# EAGLE design simple-buffer-with-jacks-V0-2 (EAGLE 7.5.0)
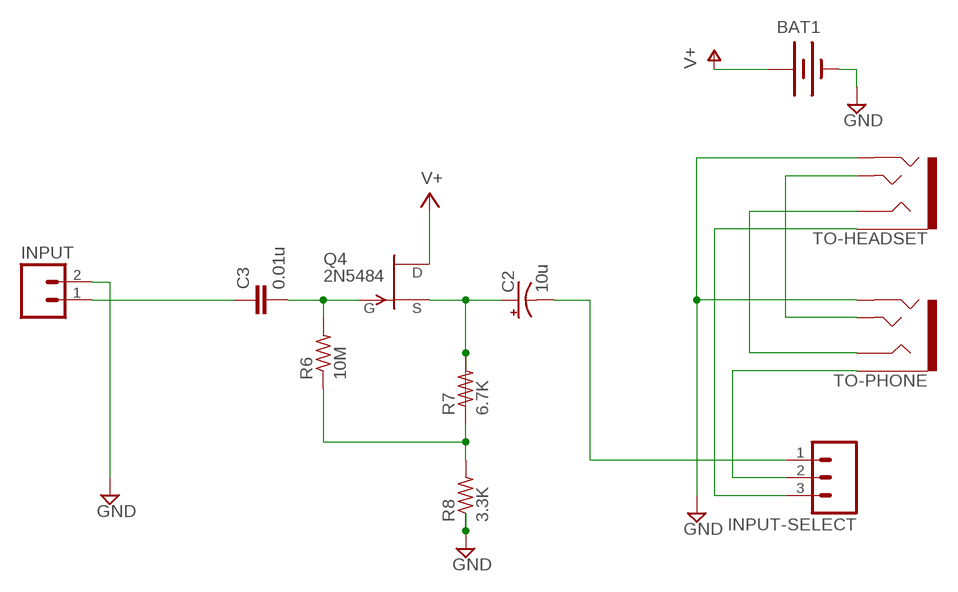
[diagram p0: schematic, sheet 1]

## Parts
BAT1  BATTERYAAA-KIT  [BATTERY-AAA-KIT]
C2  10u  CAP_POLPTH2  [CPOL-RADIAL-10UF-25V]
C3  0.01u  C5/3  [C5B3]
INPUT  M02LOCK  [1X02_LOCK]
INPUT-SELECT  M03LOCK  [1X03_LOCK]
Q4  2N5484  [TO92-]
R6  10M  R-US_0414/5V  [0414V]
R7  6.7K  R-US_0414/5V  [0414V]
R8  3.3K  R-US_0414/5V  [0414V]
TO-HEADSET  AUDIO-JACK3  [AUDIO-JACK-TRRS-SMD]
TO-PHONE  AUDIO-JACK3  [AUDIO-JACK-TRRS-SMD]

## Nets
GND: BAT1.GND@1(-) INPUT.2 R8.1 TO-HEADSET.RING2 TO-PHONE.RING2
JFET-GATE: C3.2 Q4.1(G) R6.2
JFET-SOURCE: C2.1(+) Q4.2(S) R7.2
N$1: C3.1 INPUT.1
N$2: C2.2(-) INPUT-SELECT.1
N$7: INPUT-SELECT.3 TO-HEADSET.EARTH
N$8: TO-HEADSET.TIP TO-PHONE.TIP
N$9: TO-HEADSET.RING1 TO-PHONE.RING1
N$10: R6.1 R7.1 R8.2
TO-PHONE: INPUT-SELECT.2 TO-PHONE.EARTH
V+: BAT1.PWR@1(+) Q4.3(D)

## Library data of the parts
BAT1 = Daniel:BATTERY: Battery Holders Various common sizes : AA, AAA, 18650 (PRT-12895), 20mm coin cell and 12mm coin cell. 20MM_4LEGS, BATT-10373; PROD_ID: BATT-08571
C2 = SparkFun-Passives:CAP_POL: Capacitor Polarized These are standard SMD and PTH capacitors. Normally 10uF, 47uF, and 100uF in electrolytic and tantalum varieties. Always verify the external diameter of the through hole cap, it varies with capacity, voltage, and manufacturer. The EIA devices should be standard.
C3 = capacitor-wima:C: CAPACITOR naming: grid - package width
INPUT = CMU-ArtFab:M02: Header 2 Standard 2-pin 0.1" header. Use with straight break away headers (SKU : PRT-00116), right angle break away headers (PRT-00553), swiss pins (PRT-00743), machine pins (PRT-00117), and female headers (PRT-00115). Molex polarized connector foot print use with SKU : PRT-08233 with associated crimp pins and housings.
INPUT-SELECT = SparkFun-Connectors:M03: Header 3 Standard 3-pin 0.1" header. Use with straight break away headers (SKU : PRT-00116), right angle break away headers (PRT-00553), swiss pins (PRT-00743), machine pins (PRT-00117), and female headers (PRT-00115). Molex polarized connector foot print use with SKU : PRT-08232 with associated crimp pins and housings.
Q4 = transistor-fet:?548*: N-Channel JFETs Source: VISHAY 2N5484.pdf Compatible: TO92 2N5245 J304 J305 U310 J308 J309 J310 TO72 2N4416 2N4416A 2N3823 2N4351 3N169 3N170 3N171 MFE3002 TO18 2N3796 2N3797 MFE825 Source: Motorola European Master Guide Pacge 3-59
R6-R8 = resistor:R-US_: RESISTOR, American symbol
TO-HEADSET TO-PHONE = SparkFun-Connectors:AUDIO-JACK3: Audio jack - 3.5mm TRRS variety - two rings.

## Board
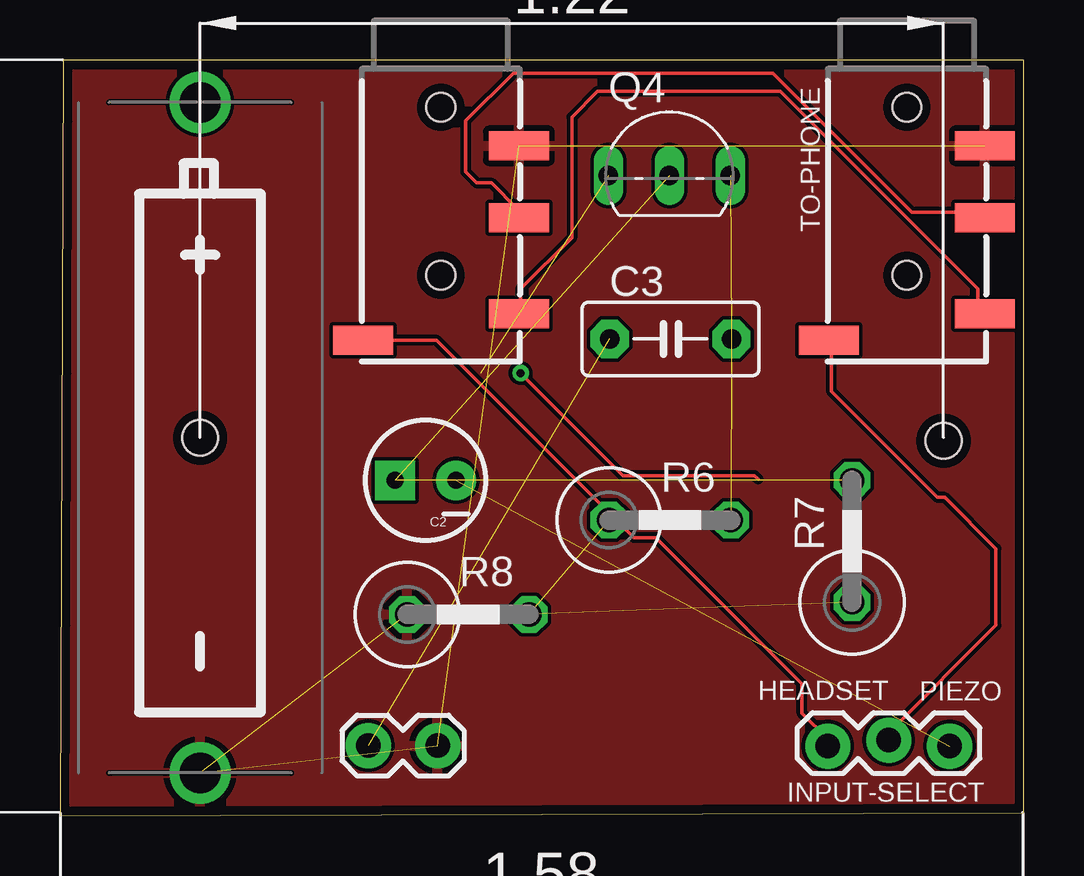
[diagram p1: board, top side]
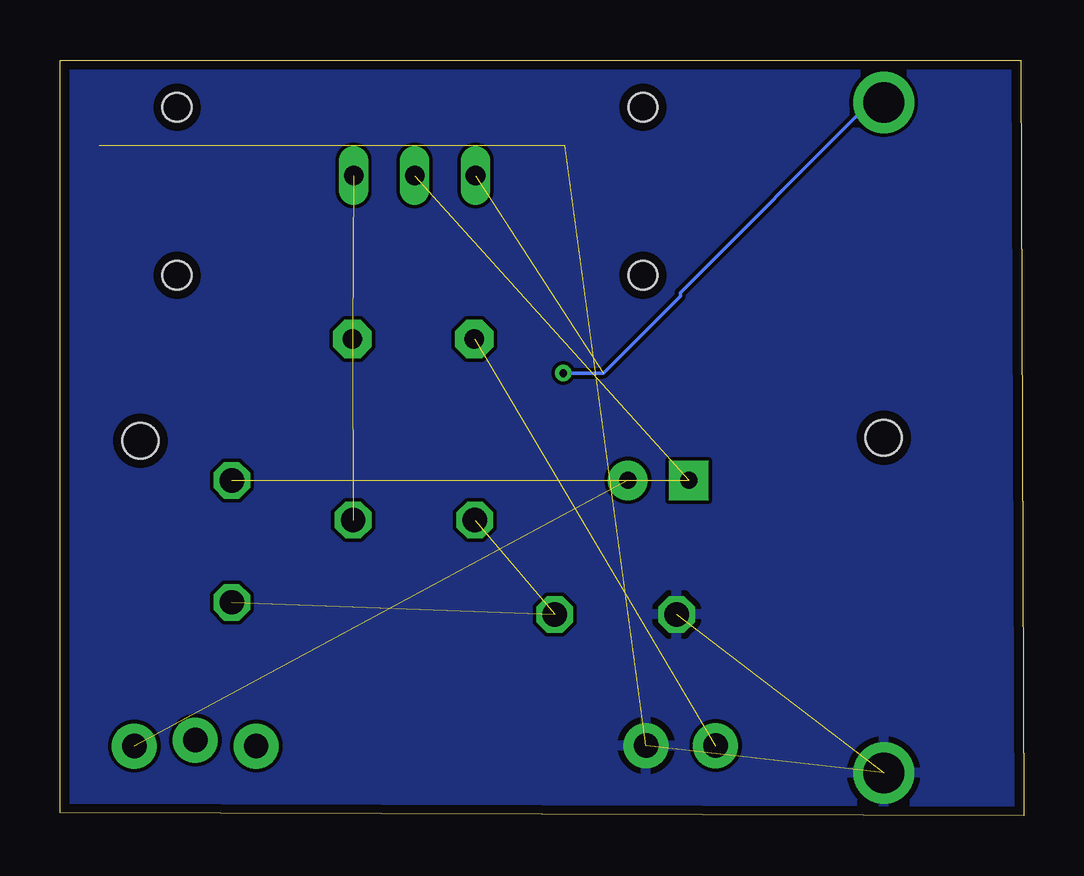
[diagram p2: board, bottom side, seen from below]

Size 40.18 x 31.49 mm. Coordinates in mm from the lower left corner, seen from the top.
Outline: 0,0 40.18,0.13 40.18,31.49 0.13,31.49 0,0
Copper layers (1*16): Top 0.0356mm / dielectric 1.5011mm / Bottom 0.0356mm
Design rules "oshpark-2layer": minimum track width 6mil, minimum drill 13mil, track to track 6mil, track to pad 6mil, pad to pad 6mil, via to via 6mil, smd to smd 6mil, copper to edge 15mil, drill to drill 6mil, minimum pad ring 7mil, minimum via ring 7mil, stop-mask expansion 2.5mil, vias tented up to drill 0mil, thermal gap 10mil
Holes 1.5 mm at 36.83,15.62 5.84,15.75

### Footprints (pad centres in the part's own frame; a part is rotated, then mirrored left to right if it is on the bottom)
BATTERY-AAA-KIT = drill 1.702: GND@1 13.97,0; PWR@1 -13.97,0
CPOL-RADIAL-10UF-25V = drill 0.7 pad 1.651 square: 1 1.27,0 | drill 0.7 pad 1.651: 2 -1.27,0
C5B3 = drill 0.813 pad 1.6 octagon: 1 -2.54,0; 2 2.54,0
1X02_LOCK = drill 1.016 pad 1.88: 1 -0.178,0; 2 2.718,0
1X03_LOCK = drill 1.016 pad 1.88: 1 0,0.127; 2 2.54,-0.127; 3 5.08,0.127
TO92- = drill 0.813 long: 1 2.54,0; 2 0,0; 3 -2.54,0
0414V = drill 1.016 octagon: 1 -2.54,0; 2 2.54,0
AUDIO-JACK-TRRS-SMD = smd 1.2 x 2.5: EARTH 11.3,-3.25; RING1 6.2,3.25; RING2 3.2,3.25; TIP 10.2,3.25 | hole 1.2: 1.6,0; 8.6,0

### Placement (x,y rotation side)
BAT1  5.84,15.75 270 top
C2  15.24,13.97 180 top
C3  25.45,19.86 0 top
INPUT  13.03,2.92 0 top
INPUT-SELECT  37.08,3.02 180 top
Q4  25.4,26.67 0 top
R6  25.43,12.32 0 top
R7  33.02,11.43 90 top
R8  17.02,8.38 0 top
TO-HEADSET  15.88,31.11 270 top
TO-PHONE  35.31,31.11 270 top

### Tracks (layer width: path | path; a pad name or v marks a point on that pad's centre or on a via)
GND  (4 unrouted)
  pour Top: 0,0.13 40.13,0.13 40.13,31.11 0,31.11
  pour Bottom: 0,0.13 40.13,0.13 40.13,31.11 0,31.11
JFET-GATE  (2 unrouted)
JFET-SOURCE  (2 unrouted)
N$1  (1 unrouted)
N$2  (1 unrouted)
N$7
  Top 0.152: INPUT-SELECT.3 32,3.2 30.94,4.27 30.94,5.49 24.84,11.58 23.93,11.58 15.7,19.81 12.65,19.81 TO-HEADSET.EARTH
N$8
  Top 0.152: TO-HEADSET.TIP 19.2,21.03 19.2,21.95 21.34,24.08 21.34,29.11 22.4,30.18 30.02,30.18 38.25,21.95 38.25,21.49 38.41,21.34 38.41,21.03 TO-PHONE.TIP
N$9
  Top 0.152: TO-HEADSET.RING1 19.05,24.99 19.05,25.3 17.98,26.36 17.37,26.36 16.92,26.82 16.92,28.96 18.9,30.94 29.72,30.94 35.51,25.15 38.25,25.15 38.41,24.99 TO-PHONE.RING1
N$10  (2 unrouted)
TO-PHONE
  Top 0.152: TO-PHONE.EARTH 32.16,19.81 32.16,17.68 36.58,13.26 36.88,13.26 39.01,11.12 39.01,7.92 34.59,3.5 34.59,3.2 INPUT-SELECT.2
V+  (via drill 0.33)  (1 unrouted)
  Top 0.152: 29.11,14.02 28.96,14.17 23.47,14.17 v19.2,18.44
  Bottom 0.152: BAT1.PWR@1 6.4,29.72 14.33,21.79 14.33,21.64 17.53,18.44 v19.2,18.44